# Altium schematic sheet cpu.SchDoc
size A4
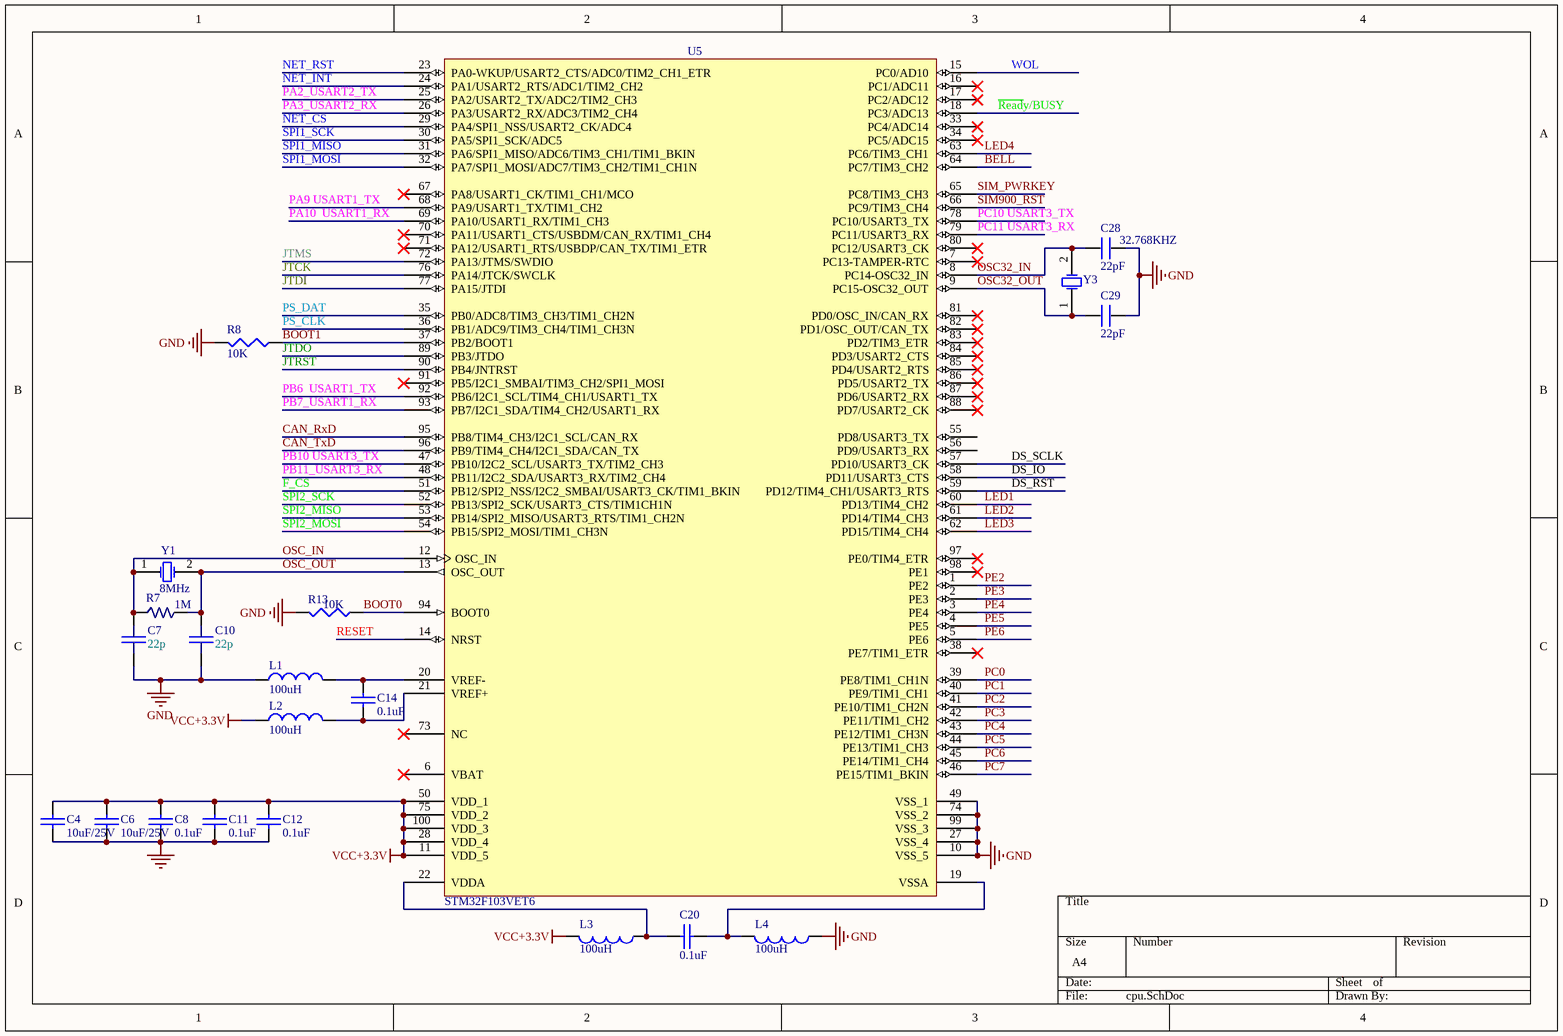
[diagram p0: cpu.SchDoc]

## Parts
C4  10uF/25V  [0805]
C6  10uF/25V  [0805]
C7  22p  [0603]
C8  0.1uF  [0603]
C10  22p  [0603]
C11  0.1uF  [0603]
C12  0.1uF  [0603]
C14  0.1uF  [0603]
C20  0.1uF  [0603]
C28  22pF  [0603]
C29  22pF  [0603]
L1  100uH  [0805]
L2  100uH  [0805]
L3  100uH  [0805]
L4  100uH  [0805]
R7  1M  [0805]
R8  10K  [0805]
R13  10K  [0603]
U5  STM32F103VET6  [LQFP100_N]
Y1  8MHz  [XTAL_US]
Y3  32.768KHZ  [CS-308]

## Nets
GND: C4.1 C6.1 C7.2 C8.1 C10.2 C11.1 C12.1 C28.1 C29.1 L1.1 L4.1 R8.2 R13.2 U5.10(VSS_5) U5.27(VSS_4) U5.49(VSS_1) U5.74(VSS_2) U5.99(VSS_3)
VCC+3.3V: C4.2 C6.2 C8.2 C11.2 C12.2 L2.1 L3.2 U5.11(VDD_5) U5.28(VDD_4) U5.50(VDD_1) U5.75(VDD_2) U5.100(VDD_3)
BELL: U5.64(PC7/TIM3_CH2)
BOOT0: R13.1 U5.94(BOOT0)
BOOT1: R8.1 U5.37(PB2/BOOT1)
CAN_RxD: U5.95(PB8/TIM4_CH3/I2C1_SCL/CAN_RX)
CAN_TxD: U5.96(PB9/TIM4_CH4/I2C1_SDA/CAN_TX)
DS_IO: U5.58(PD11/USART3_CTS)
DS_RST: U5.59(PD12/TIM4_CH1/USART3_RTS)
DS_SCLK: U5.57(PD10/USART3_CK)
F_CS: U5.51(PB12/SPI2_NSS/I2C2_SMBAI/USART3_CK/TIM1_BKIN)
JTCK: U5.76(PA14/JTCK/SWCLK)
JTDI: U5.77(PA15/JTDI)
JTDO: U5.89(PB3/JTDO)
JTMS: U5.72(PA13/JTMS/SWDIO)
JTRST: U5.90(PB4/JNTRST)
LED1: U5.60(PD13/TIM4_CH2)
LED2: U5.61(PD14/TIM4_CH3)
LED3: U5.62(PD15/TIM4_CH4)
LED4: U5.63(PC6/TIM3_CH1)
NET_CS: U5.29(PA4/SPI1_NSS/USART2_CK/ADC4)
NET_INT: U5.24(PA1/USART2_RTS/ADC1/TIM2_CH2)
NET_RST: U5.23(PA0-WKUP/USART2_CTS/ADC0/TIM2_CH1_ETR)
OSC32_IN: C28.2 U5.8(PC14-OSC32_IN) Y3.2(OSC2)
OSC32_OUT: C29.2 U5.9(PC15-OSC32_OUT) Y3.1(OSC1)
OSC_IN: C7.1 R7.1 U5.12(OSC_IN) Y1.1(OSC1)
OSC_OUT: C10.1 R7.2 U5.13(OSC_OUT) Y1.2(OSC2)
PA2_USART2_TX: U5.25(PA2/USART2_TX/ADC2/TIM2_CH3)
PA3_USART2_RX: U5.26(PA3/USART2_RX/ADC3/TIM2_CH4)
PA9 USART1_TX: U5.68(PA9/USART1_TX/TIM1_CH2)
PA10  USART1_RX: U5.69(PA10/USART1_RX/TIM1_CH3)
PB6  USART1_TX: U5.92(PB6/I2C1_SCL/TIM4_CH1/USART1_TX)
PB7_USART1_RX: U5.93(PB7/I2C1_SDA/TIM4_CH2/USART1_RX)
PB10 USART3_TX: U5.47(PB10/I2C2_SCL/USART3_TX/TIM2_CH3)
PB11_USART3_RX: U5.48(PB11/I2C2_SDA/USART3_RX/TIM2_CH4)
PC0: U5.39(PE8/TIM1_CH1N)
PC1: U5.40(PE9/TIM1_CH1)
PC2: U5.41(PE10/TIM1_CH2N)
PC3: U5.42(PE11/TIM1_CH2)
PC4: U5.43(PE12/TIM1_CH3N)
PC5: U5.44(PE13/TIM1_CH3)
PC6: U5.45(PE14/TIM1_CH4)
PC7: U5.46(PE15/TIM1_BKIN)
PC10 USART3_TX: U5.78(PC10/USART3_TX)
PC11 USART3_RX: U5.79(PC11/USART3_RX)
PE2: U5.1(PE2)
PE3: U5.2(PE3)
PE4: U5.3(PE4)
PE5: U5.4(PE5)
PE6: U5.5(PE6)
PS_CLK: U5.36(PB1/ADC9/TIM3_CH4/TIM1_CH3N)
PS_DAT: U5.35(PB0/ADC8/TIM3_CH3/TIM1_CH2N)
~{Read}y/BUSY: U5.18(PC3/ADC13)
RESET: U5.14(NRST)
SIM900_RST: U5.66(PC9/TIM3_CH4)
SIM_PWRKEY: U5.65(PC8/TIM3_CH3)
SPI1_MISO: U5.31(PA6/SPI1_MISO/ADC6/TIM3_CH1/TIM1_BKIN)
SPI1_MOSI: U5.32(PA7/SPI1_MOSI/ADC7/TIM3_CH2/TIM1_CH1N)
SPI1_SCK: U5.30(PA5/SPI1_SCK/ADC5)
SPI2_MISO: U5.53(PB14/SPI2_MISO/USART3_RTS/TIM1_CH2N)
SPI2_MOSI: U5.54(PB15/SPI2_MOSI/TIM1_CH3N)
SPI2_SCK: U5.52(PB13/SPI2_SCK/USART3_CTS/TIM1CH1N)
WOL: U5.15(PC0/AD10)
NetC14_1: C14.1 L1.2 U5.20(VREF-)
NetC14_2: C14.2 L2.2 U5.21(VREF+)
NetC20_1: C20.1 L3.1 U5.22(VDDA)
NetC20_2: C20.2 L4.2 U5.19(VSSA)

Not connected (* = marked no-connect by the designer): U5 6(VBAT)* 7(PC13-TAMPER-RTC)* 16(PC1/ADC11)* 17(PC2/ADC12)* 33(PC4/ADC14)* 34(PC5/ADC15)* 38(PE7/TIM1_ETR)* 55(PD8/USART3_TX) 56(PD9/USART3_RX) 67(PA8/USART1_CK/TIM1_CH1/MCO)* 70(PA11/USART1_CTS/USBDM/CAN_RX/TIM1_CH4)* 71(PA12/USART1_RTS/USBDP/CAN_TX/TIM1_ETR)* 73(NC)* 80(PC12/USART3_CK)* 81(PD0/OSC_IN/CAN_RX)* 82(PD1/OSC_OUT/CAN_TX)* 83(PD2/TIM3_ETR)* 84(PD3/USART2_CTS)* 85(PD4/USART2_RTS)* 86(PD5/USART2_TX)* 87(PD6/USART2_RX)* 88(PD7/USART2_CK)* 91(PB5/I2C1_SMBAI/TIM3_CH2/SPI1_MOSI)* 97(PE0/TIM4_ETR)* 98(PE1)*

## Library data of the parts
C4 C6 C8 C11 C12 C14 C20 = CAP
C7 C10 = CAP: 陶瓷电容
C28 C29 = C
L1-L4 = INDUCTOR
R7 = RES-1%: 高精度电阻
R8 R13 = RES1
U5 = STM32F103VET6: STM32 ARM-based 32-bit MCU with 64 Kbytes Flash, 100-pin LQFP, Industrial Temperature; Published: 30-May-2008; DatasheetVersion: rev6, Mar-2008; PackageVersion: Mar-2008; PackageReference: LQFP100; Publisher: Altium Limited; PackageDescription: 100-Pin Low-Profile Quad Flat Pack, 14 x 14 mm Body, 0.5 mm Pitch (LQFP100); ComponentLink1Description: Manufacturer Link; ComponentLink1URL: www.st.com/stm32; ComponentLink2Description: Datasheet; ComponentLink2URL: http://www.st.com/stonline/products/literature/ds/13587.pdf
Y1 Y3 = XTAL: Crystal Oscillator; Published: 8-Jun-2000; LatestRevisionDate: 17-Jul-2002; LatestRevisionNote: Re-released for DXP Platform.; Publisher: Altium Limited